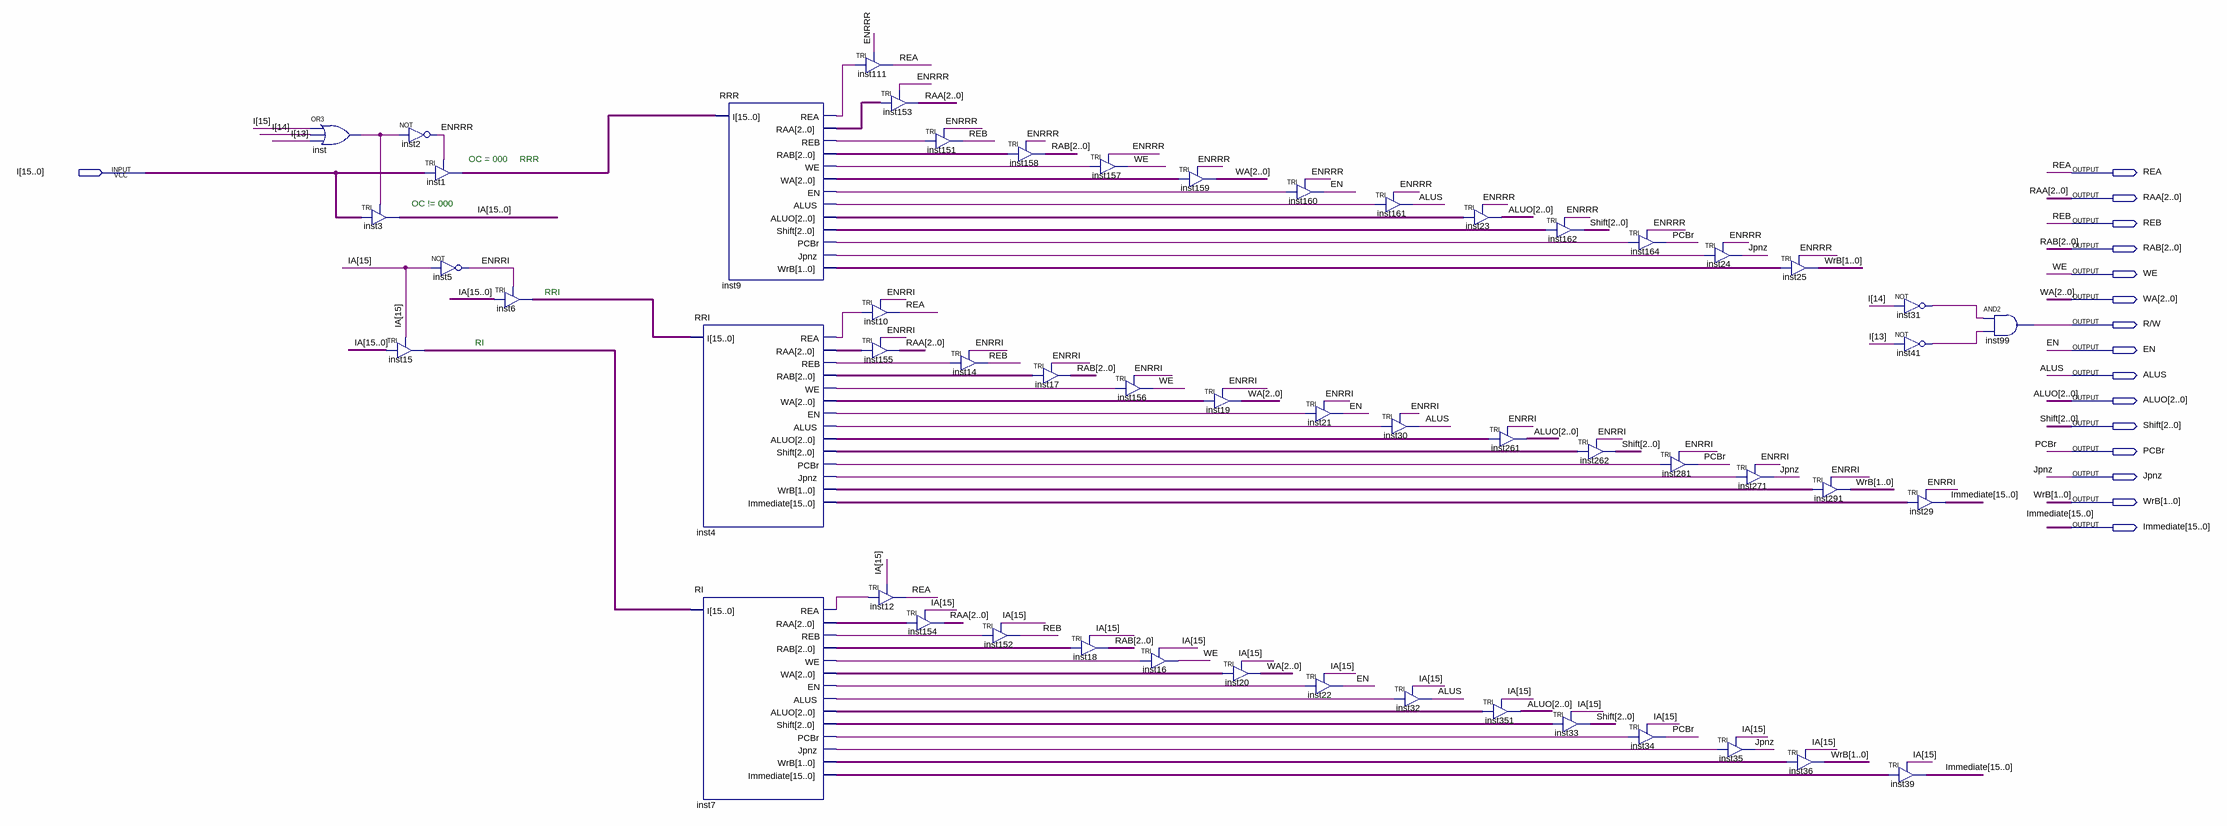
[diagram p0: schematic sheet]
// Quartus schematic ControlUnit.bdf as structural Verilog: 54 symbols, 16 pins
module ControlUnit (
  input  [15:0] I,
  output REA,
  output [2:0] RAA,
  output REB,
  output [2:0] RAB,
  output WE,
  output [2:0] WA,
  output \R/W ,
  output EN,
  output ALUS,
  output [2:0] ALUO,
  output [2:0] Shift,
  output PCBr,
  output Jpnz,
  output [1:0] WrB,
  output [15:0] Immediate
);

  wire ENRRI, ENRRR, inst4_alus, inst4_en, inst4_jpnz, inst4_pcbr, inst4_rea, inst4_reb, inst4_we,
       inst7_alus, inst7_en, inst7_jpnz, inst7_pcbr, inst7_rea, inst7_reb, inst7_we, inst9_alus, inst9_en,
       inst9_jpnz, inst9_pcbr, inst9_rea, inst9_reb, inst9_we, inst31_out, inst41_out, inst_out;
  wire [1:0] inst4_wrb, inst7_wrb, inst9_wrb;
  wire [2:0] inst4_aluo, inst4_raa, inst4_rab, inst4_shift, inst4_wa, inst7_aluo, inst7_raa, inst7_rab,
       inst7_shift, inst7_wa, inst9_aluo, inst9_raa, inst9_rab, inst9_shift, inst9_wa;
  wire [15:0] IA, inst1_out, inst4_immediate, inst6_out, inst7_immediate, inst15_out;

  or inst (inst_out, I[15], I[14], I[13]);
  TRI inst3[15:0] (.IN(I), .OE(inst_out), .OUT(IA));
  TRI inst15[15:0] (.IN(IA), .OE(IA[15]), .OUT(inst15_out));
  not inst2 (ENRRR, inst_out);
  TRI inst1[15:0] (.IN(I), .OE(ENRRR), .OUT(inst1_out));
  not inst5 (ENRRI, IA[15]);
  TRI inst6[15:0] (.IN(IA), .OE(ENRRI), .OUT(inst6_out));
  RRI inst4 (
    .I(inst6_out), .REA(inst4_rea), .RAA(inst4_raa), .REB(inst4_reb), .RAB(inst4_rab), .WE(inst4_we),
    .WA(inst4_wa), .EN(inst4_en), .ALUS(inst4_alus), .ALUO(inst4_aluo), .Shift(inst4_shift),
    .PCBr(inst4_pcbr), .Jpnz(inst4_jpnz), .WrB(inst4_wrb), .Immediate(inst4_immediate));
  RI inst7 (
    .I(inst15_out), .REA(inst7_rea), .RAA(inst7_raa), .REB(inst7_reb), .RAB(inst7_rab), .WE(inst7_we),
    .WA(inst7_wa), .EN(inst7_en), .ALUS(inst7_alus), .ALUO(inst7_aluo), .Shift(inst7_shift),
    .PCBr(inst7_pcbr), .Jpnz(inst7_jpnz), .WrB(inst7_wrb), .Immediate(inst7_immediate));
  RRR inst9 (
    .I(inst1_out), .REA(inst9_rea), .RAA(inst9_raa), .REB(inst9_reb), .RAB(inst9_rab), .WE(inst9_we),
    .WA(inst9_wa), .EN(inst9_en), .ALUS(inst9_alus), .ALUO(inst9_aluo), .Shift(inst9_shift),
    .PCBr(inst9_pcbr), .Jpnz(inst9_jpnz), .WrB(inst9_wrb));
  TRI inst111 (.IN(inst9_rea), .OE(ENRRR), .OUT(REA));
  TRI inst153[2:0] (.IN(inst9_raa), .OE(ENRRR), .OUT(RAA));
  TRI inst10 (.IN(inst4_rea), .OE(ENRRI), .OUT(REA));
  TRI inst155[2:0] (.IN(inst4_raa), .OE(ENRRI), .OUT(RAA));
  TRI inst12 (.IN(inst7_rea), .OE(IA[15]), .OUT(REA));
  TRI inst151 (.IN(inst9_reb), .OE(ENRRR), .OUT(REB));
  TRI inst154[2:0] (.IN(inst7_raa), .OE(IA[15]), .OUT(RAA));
  TRI inst14 (.IN(inst4_reb), .OE(ENRRI), .OUT(REB));
  TRI inst152 (.IN(inst7_reb), .OE(IA[15]), .OUT(REB));
  TRI inst158[2:0] (.IN(inst9_rab), .OE(ENRRR), .OUT(RAB));
  TRI inst17[2:0] (.IN(inst4_rab), .OE(ENRRI), .OUT(RAB));
  TRI inst157 (.IN(inst9_we), .OE(ENRRR), .OUT(WE));
  TRI inst18[2:0] (.IN(inst7_rab), .OE(IA[15]), .OUT(RAB));
  TRI inst156 (.IN(inst4_we), .OE(ENRRI), .OUT(WE));
  TRI inst16 (.IN(inst7_we), .OE(IA[15]), .OUT(WE));
  TRI inst159[2:0] (.IN(inst9_wa), .OE(ENRRR), .OUT(WA));
  TRI inst19[2:0] (.IN(inst4_wa), .OE(ENRRI), .OUT(WA));
  TRI inst20[2:0] (.IN(inst7_wa), .OE(IA[15]), .OUT(WA));
  TRI inst160 (.IN(inst9_en), .OE(ENRRR), .OUT(EN));
  TRI inst21 (.IN(inst4_en), .OE(ENRRI), .OUT(EN));
  TRI inst22 (.IN(inst7_en), .OE(IA[15]), .OUT(EN));
  TRI inst161 (.IN(inst9_alus), .OE(ENRRR), .OUT(ALUS));
  TRI inst30 (.IN(inst4_alus), .OE(ENRRI), .OUT(ALUS));
  TRI inst32 (.IN(inst7_alus), .OE(IA[15]), .OUT(ALUS));
  TRI inst23[2:0] (.IN(inst9_aluo), .OE(ENRRR), .OUT(ALUO));
  TRI inst261[2:0] (.IN(inst4_aluo), .OE(ENRRI), .OUT(ALUO));
  TRI inst351[2:0] (.IN(inst7_aluo), .OE(IA[15]), .OUT(ALUO));
  TRI inst162[2:0] (.IN(inst9_shift), .OE(ENRRR), .OUT(Shift));
  TRI inst33[2:0] (.IN(inst7_shift), .OE(IA[15]), .OUT(Shift));
  TRI inst262[2:0] (.IN(inst4_shift), .OE(ENRRI), .OUT(Shift));
  TRI inst164 (.IN(inst9_pcbr), .OE(ENRRR), .OUT(PCBr));
  TRI inst34 (.IN(inst7_pcbr), .OE(IA[15]), .OUT(PCBr));
  TRI inst24 (.IN(inst9_jpnz), .OE(ENRRR), .OUT(Jpnz));
  TRI inst281 (.IN(inst4_pcbr), .OE(ENRRI), .OUT(PCBr));
  TRI inst271 (.IN(inst4_jpnz), .OE(ENRRI), .OUT(Jpnz));
  TRI inst35 (.IN(inst7_jpnz), .OE(IA[15]), .OUT(Jpnz));
  TRI inst25[1:0] (.IN(inst9_wrb), .OE(ENRRR), .OUT(WrB));
  TRI inst36[1:0] (.IN(inst7_wrb), .OE(IA[15]), .OUT(WrB));
  TRI inst291[1:0] (.IN(inst4_wrb), .OE(ENRRI), .OUT(WrB));
  not inst31 (inst31_out, I[14]);
  not inst41 (inst41_out, I[13]);
  TRI inst29[15:0] (.IN(inst4_immediate), .OE(ENRRI), .OUT(Immediate));
  TRI inst39[15:0] (.IN(inst7_immediate), .OE(IA[15]), .OUT(Immediate));
  and inst99 (\R/W , inst31_out, inst41_out);

  // Notes on the sheet:
  //   OC = 000
  //   RRR
  //   OC != 000
  //   RRI
  //   RI
endmodule
